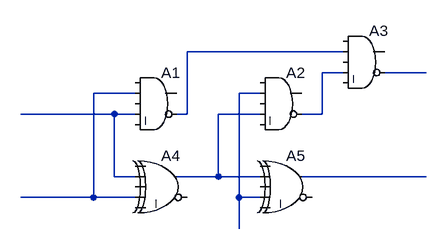
[diagram p0: schematic FA.asc]
FA.asc, the LTspice schematic file:
Version 4
SHEET 1 880 680
WIRE 352 16 112 16
WIRE 352 48 320 48
WIRE 480 48 416 48
WIRE 32 80 -32 80
WIRE 224 80 192 80
WIRE 0 112 -144 112
WIRE 32 112 0 112
WIRE 112 112 112 16
WIRE 112 112 96 112
WIRE 224 112 160 112
WIRE 320 112 320 48
WIRE 320 112 288 112
WIRE 0 208 0 112
WIRE 32 208 0 208
WIRE 160 208 160 112
WIRE 160 208 96 208
WIRE 224 208 160 208
WIRE 480 208 288 208
WIRE -32 240 -32 80
WIRE -32 240 -144 240
WIRE 32 240 -32 240
WIRE 192 240 192 80
WIRE 224 240 192 240
WIRE 192 288 192 240
SYMBOL Digital\\and 64 32 R0
SYMATTR InstName A1
SYMBOL Digital\\and 256 32 R0
SYMATTR InstName A2
SYMBOL Digital\\and 384 -32 R0
SYMATTR InstName A3
SYMBOL Digital\\xor 80 160 R0
SYMATTR InstName A4
SYMBOL Digital\\xor 272 160 R0
SYMATTR InstName A5

The netlist it stands for:
* FA.asc
A1 0 N004 0 N006 0 N001 0 0 AND
A2 0 N005 0 N007 0 N002 0 0 AND
A3 0 N001 0 N002 0 N003 0 0 AND
A4 0 N006 0 N004 0 0 N007 0 XOR
A5 0 N007 0 N005 0 0 N008 0 XOR
.backanno
.end